# EAGLE schematic esp32 (EAGLE 9.5.2)
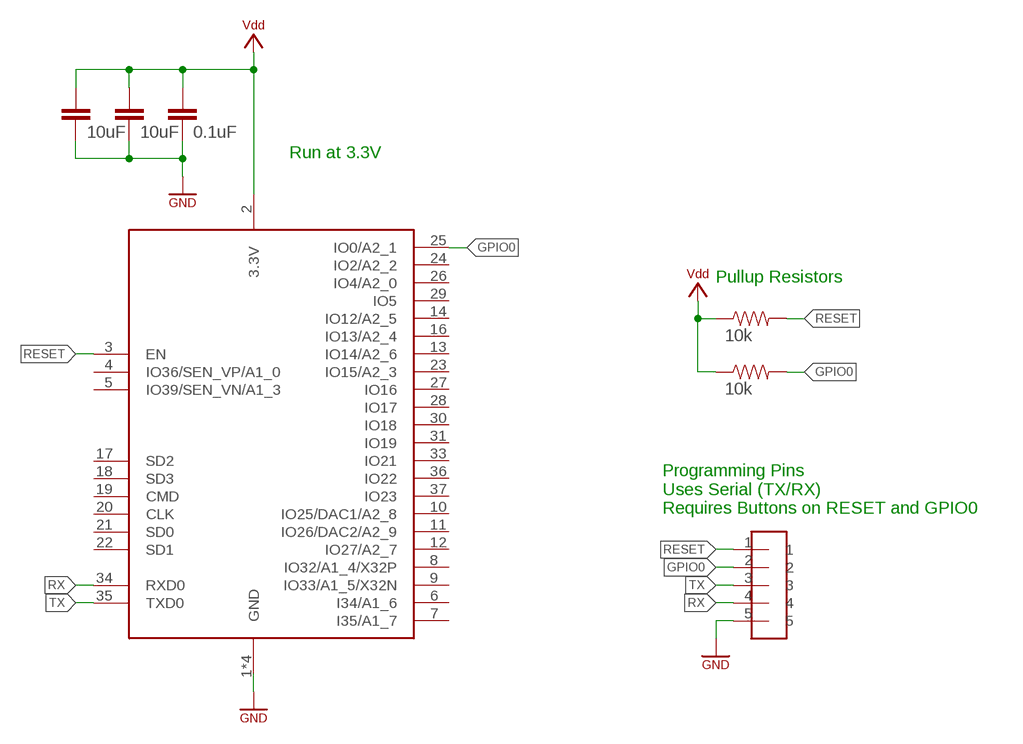
[diagram p0: schematic, sheet 1]

## Parts
C1  0.1uF  COMPONENT_CAP-0805  [0805]
C2  10uF  COMPONENT_CAP-0805  [0805]
C3  10uF  COMPONENT_CAP-0805  [0805]
R1  10k  COMPONENT_RESISTOR-0805  [0805]
R2  10k  COMPONENT_RESISTOR-0805  [0805]
U$1  HEADER-5-TESTPOINT  [TESTPOINT-5]
X1  MICRO_ESP32  [WROOM32]

## Nets
GND: C1.2 C2.2 C3.2 U$1.5 X1.1(GND) X1.15(GND) X1.38(GND) X1.P$1(GND) ; supply symbol labelled SYMBOL_GND
GPIO0: R2.2 U$1.2 X1.25(IO0/A2_1)
RESET: R1.2 U$1.1 X1.3(EN)
RX: U$1.4 X1.34(RXD0)
TX: U$1.3 X1.35(TXD0)
VDD: C1.1 C2.1 C3.1 R1.1 R2.1 X1.2(3.3V) ; supply symbol labelled SYMBOL_VDD
Unconnected: X1.4(IO36/SEN_VP/A1_0) X1.5(IO39/SEN_VN/A1_3) X1.6(I34/A1_6) X1.7(I35/A1_7) X1.8(IO32/A1_4/X32P) X1.9(IO33/A1_5/X32N) X1.10(IO25/DAC1/A2_8) X1.11(IO26/DAC2/A2_9) X1.12(IO27/A2_7) X1.13(IO14/A2_6) X1.14(IO12/A2_5) X1.16(IO13/A2_4) X1.17(SD2) X1.18(SD3) X1.19(CMD) X1.20(CLK) X1.21(SD0) X1.22(SD1) X1.23(IO15/A2_3) X1.24(IO2/A2_2) X1.26(IO4/A2_0) X1.27(IO16) X1.28(IO17) X1.29(IO5) X1.30(IO18) X1.31(IO19) X1.33(IO21) X1.36(IO22) X1.37(IO23)

## Notes on the sheet
- Run at 3.3V
- Pullup Resistors
- Programming Pins
  Uses Serial (TX/RX)
  Requires Buttons on RESET and GPIO0

## Library data of the parts
C1-C3 = homemade-hardware:COMPONENT_CAP: Capacitor Standard 0603 ceramic capacitor, and 0.1" leaded capacitor.
R1 R2 = homemade-hardware:COMPONENT_RESISTOR
U$1 = homemade-hardware:HEADER-5: NPTC081KFXC-RC <https://www.digikey.com/product-detail/en/sullins-connector-solutions/NPTC081KFXC-RC/S5600-ND/776058>: Vertical Female SMD Headers TSM-110-01-T-SV <https://www.digikey.com/product-detail/en/samtec-inc/TSM-110-01-T-SV/SAM12267-ND/6691889>: Vertical Male SMD Headers M20-8890845 <https://www.digikey.com/products/en?keywords=952-3236-ND>: Horizontal Male SMD Headers M20-7910842R <https://www.digikey.com/product-detail/en/harwin-inc/M20-7910842R/952-3200-6-ND/6559341>: Horizontal Female SMD Headers
X1 = homemade-hardware:MICRO_ESP32: WROOM-32 <https://www.digikey.com/products/en/rf-if-and-rfid/rf-transceiver-modules/872?k=wroom+32&k=&pkeyword=wroom+32&sv=0&v=1528&sf=1&FV=fffc05f8%2Cfffc0770%2C1f140000%2Cffe00368%2Cf60450e%2Cf604b7b%2Cf604b7c&quantity=&ColumnSort=0&page=1&stock=1&pageSize=25>: ESP32 Module